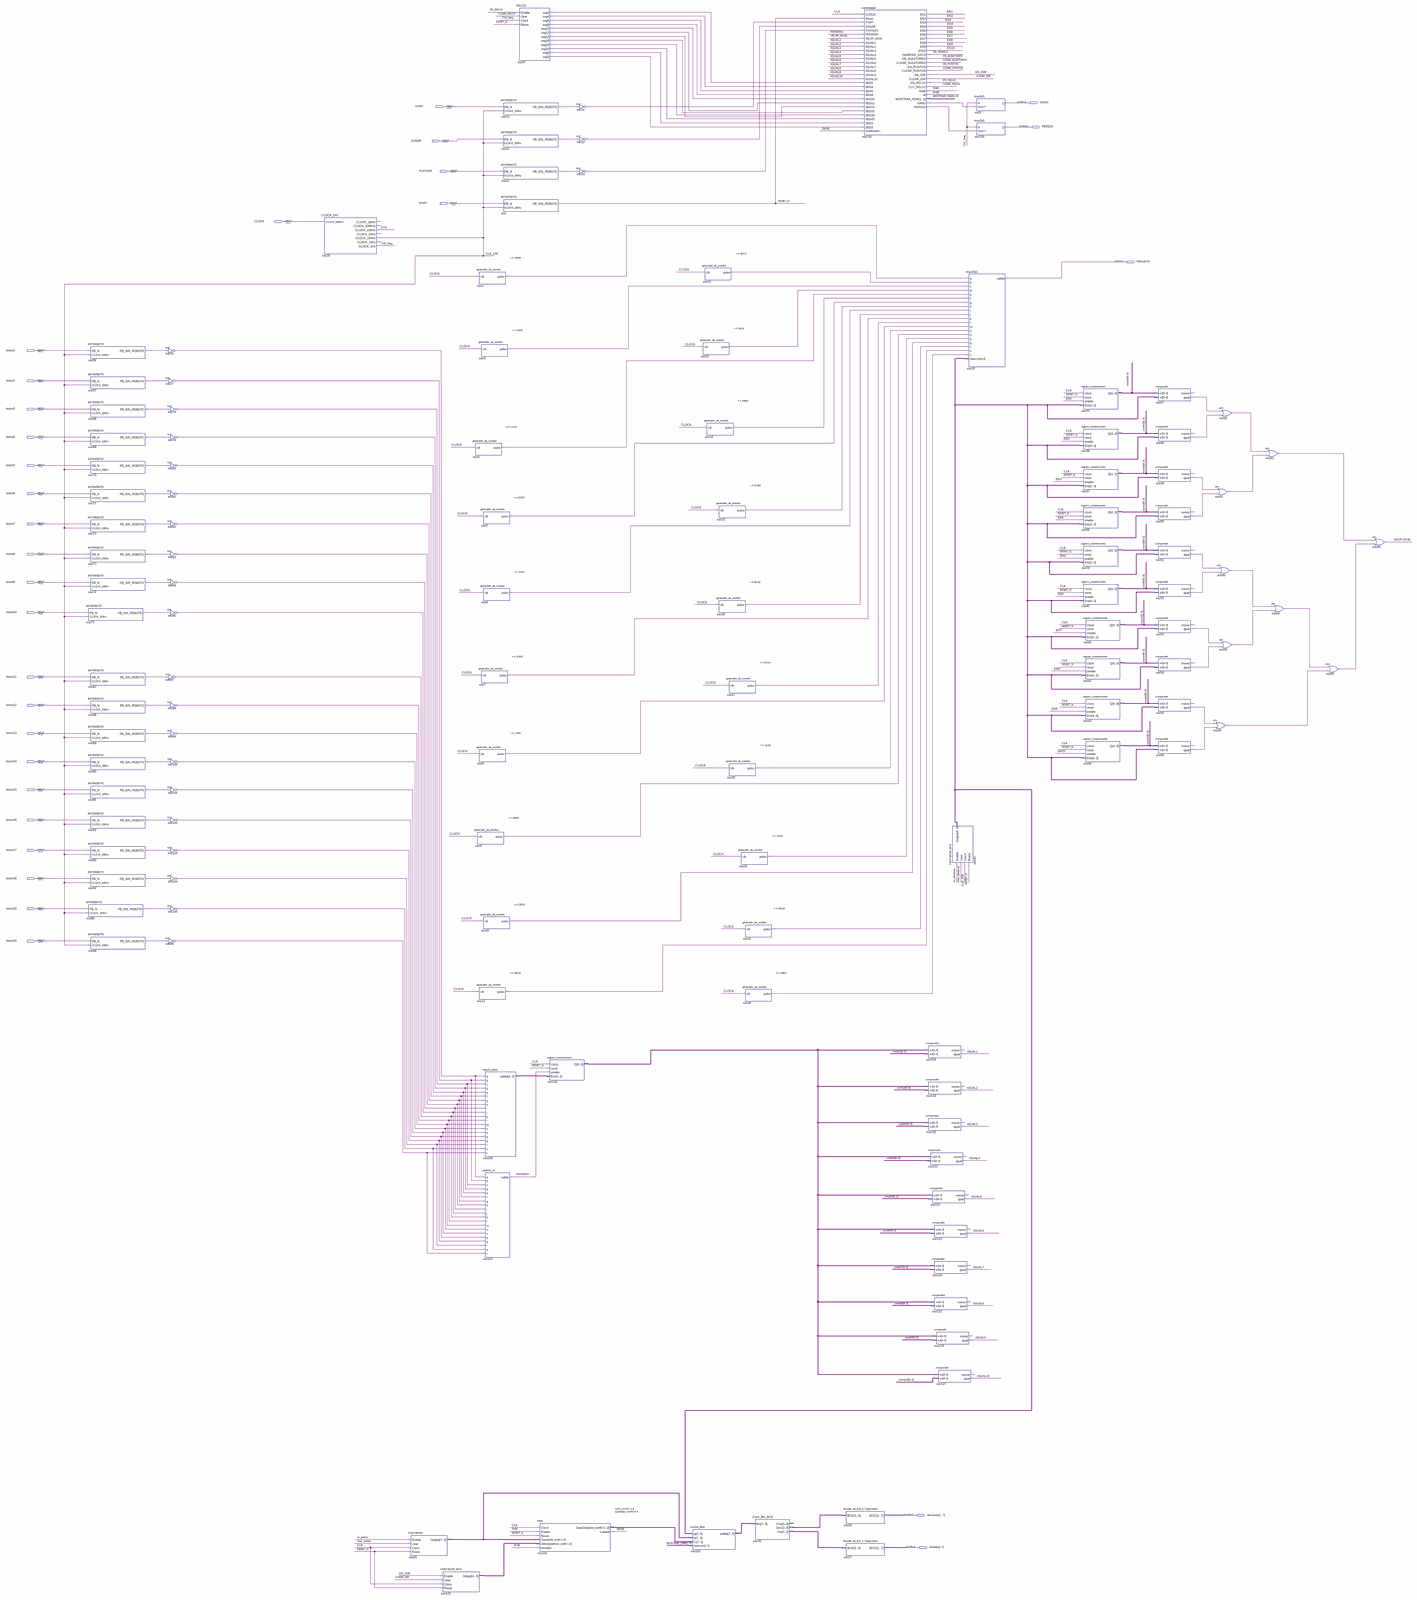
[diagram p0: schematic sheet, whole]
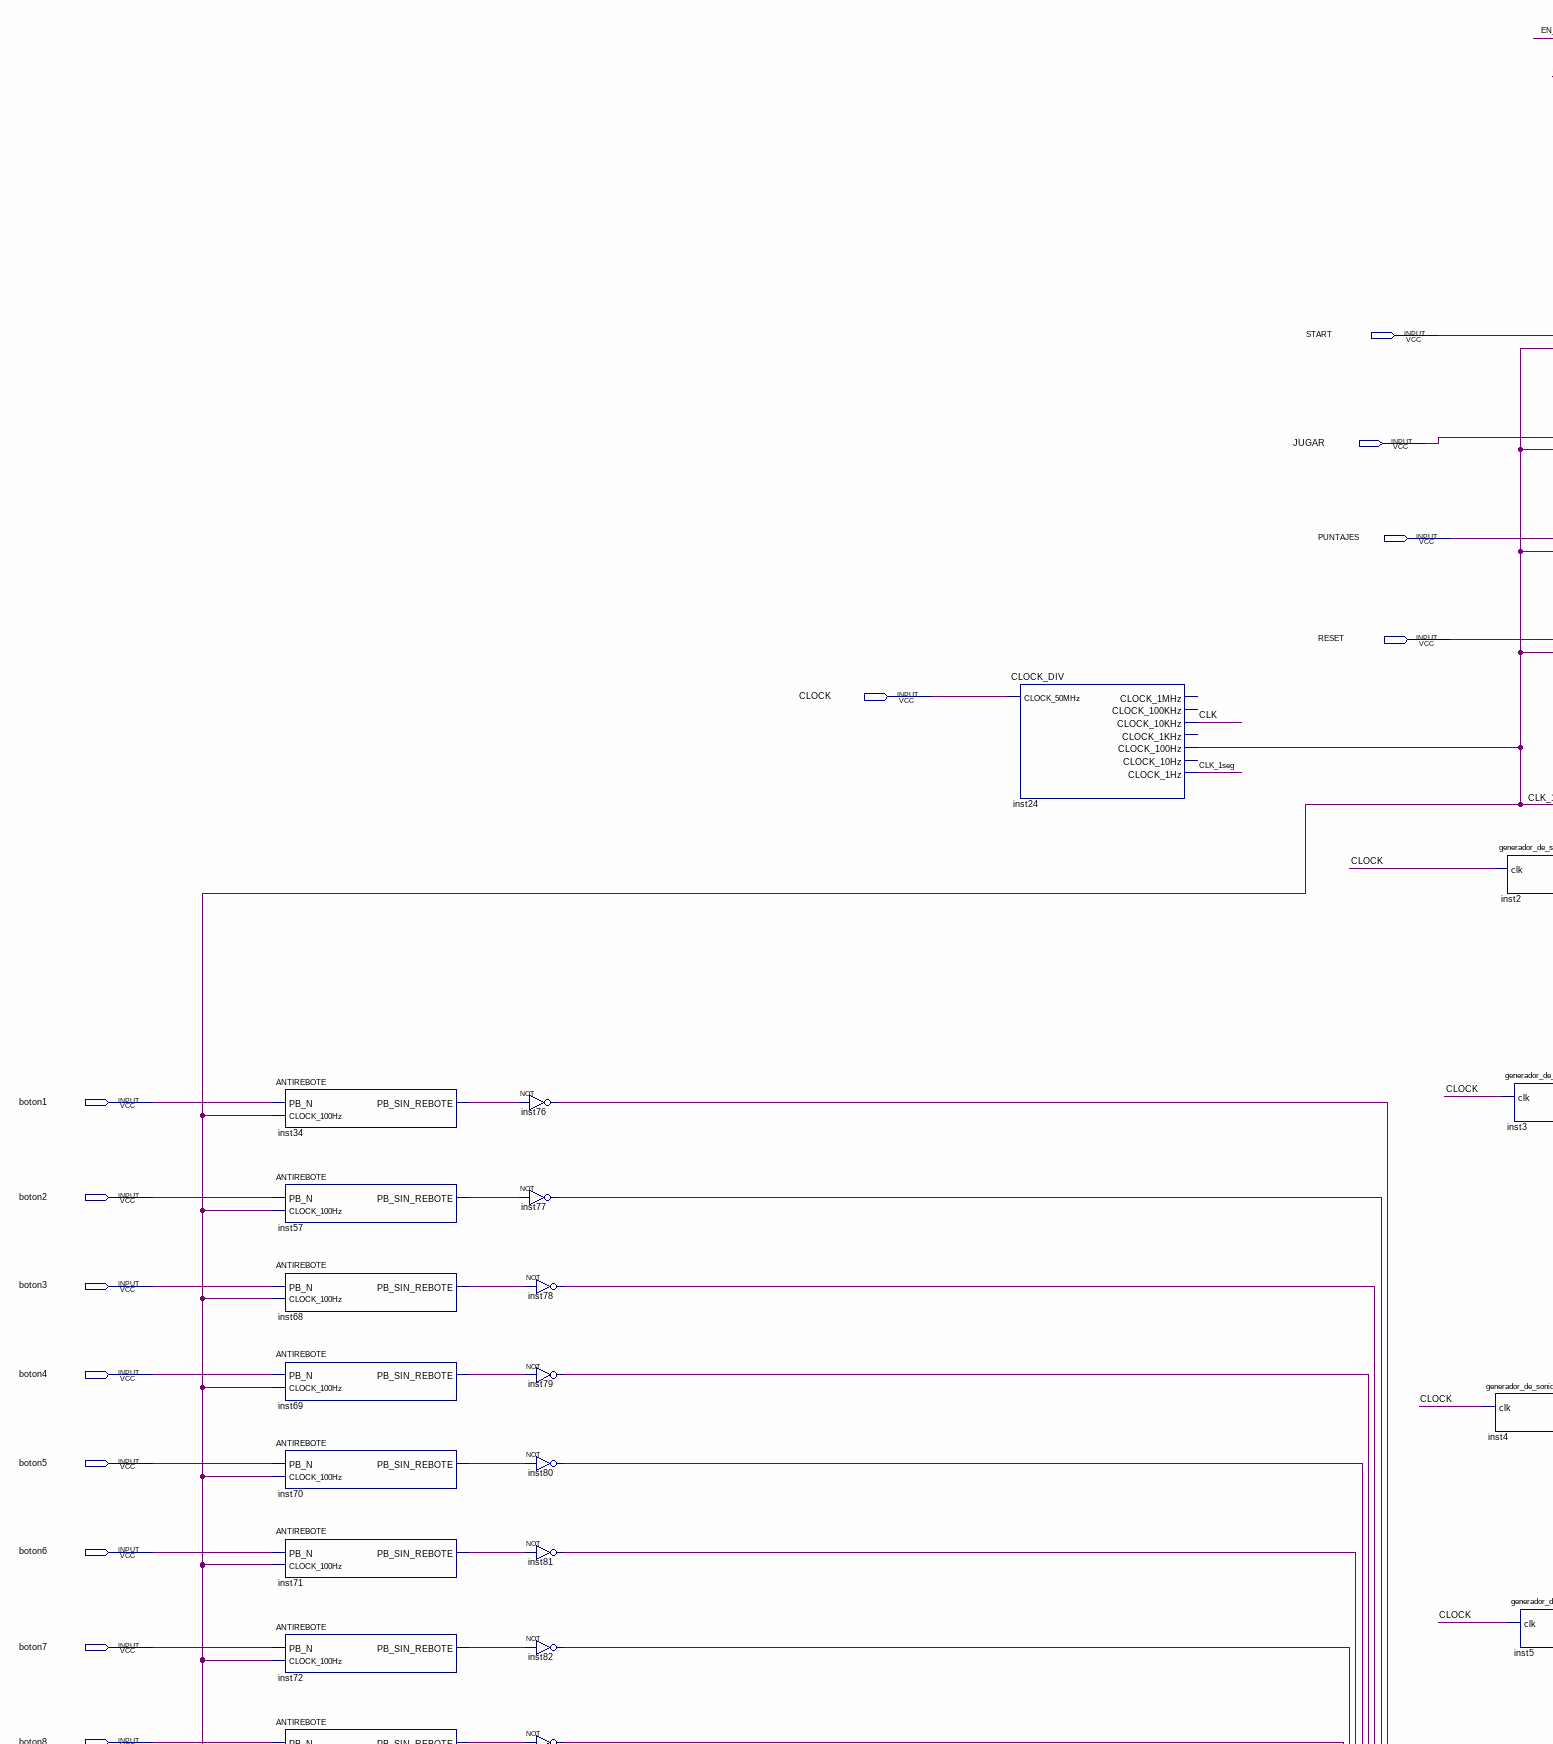
[diagram p1: schematic sheet, upper left part]
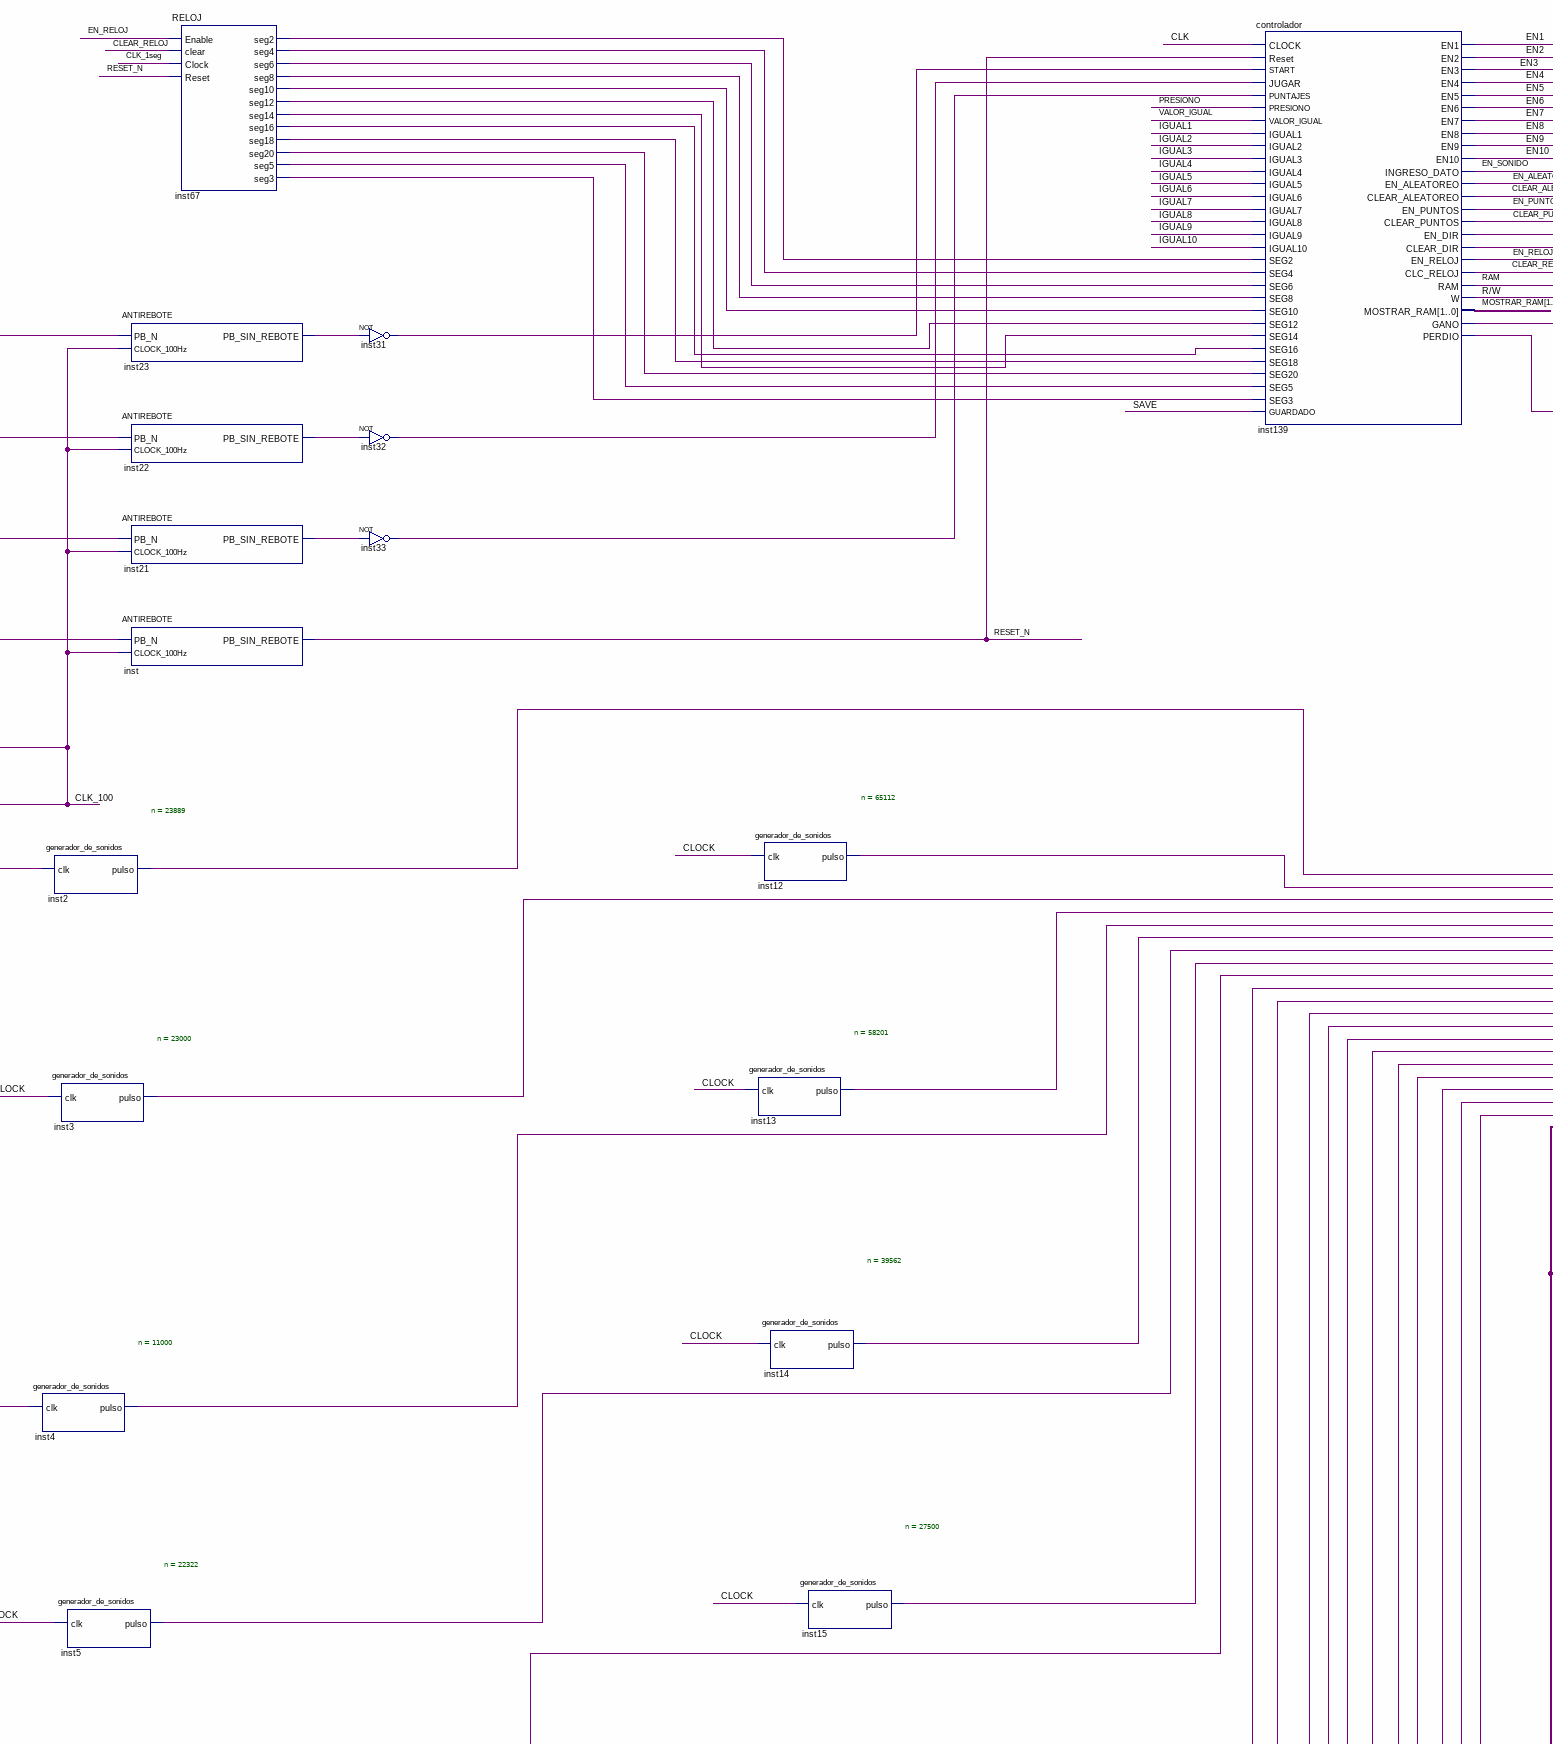
[diagram p2: schematic sheet, upper centre part]
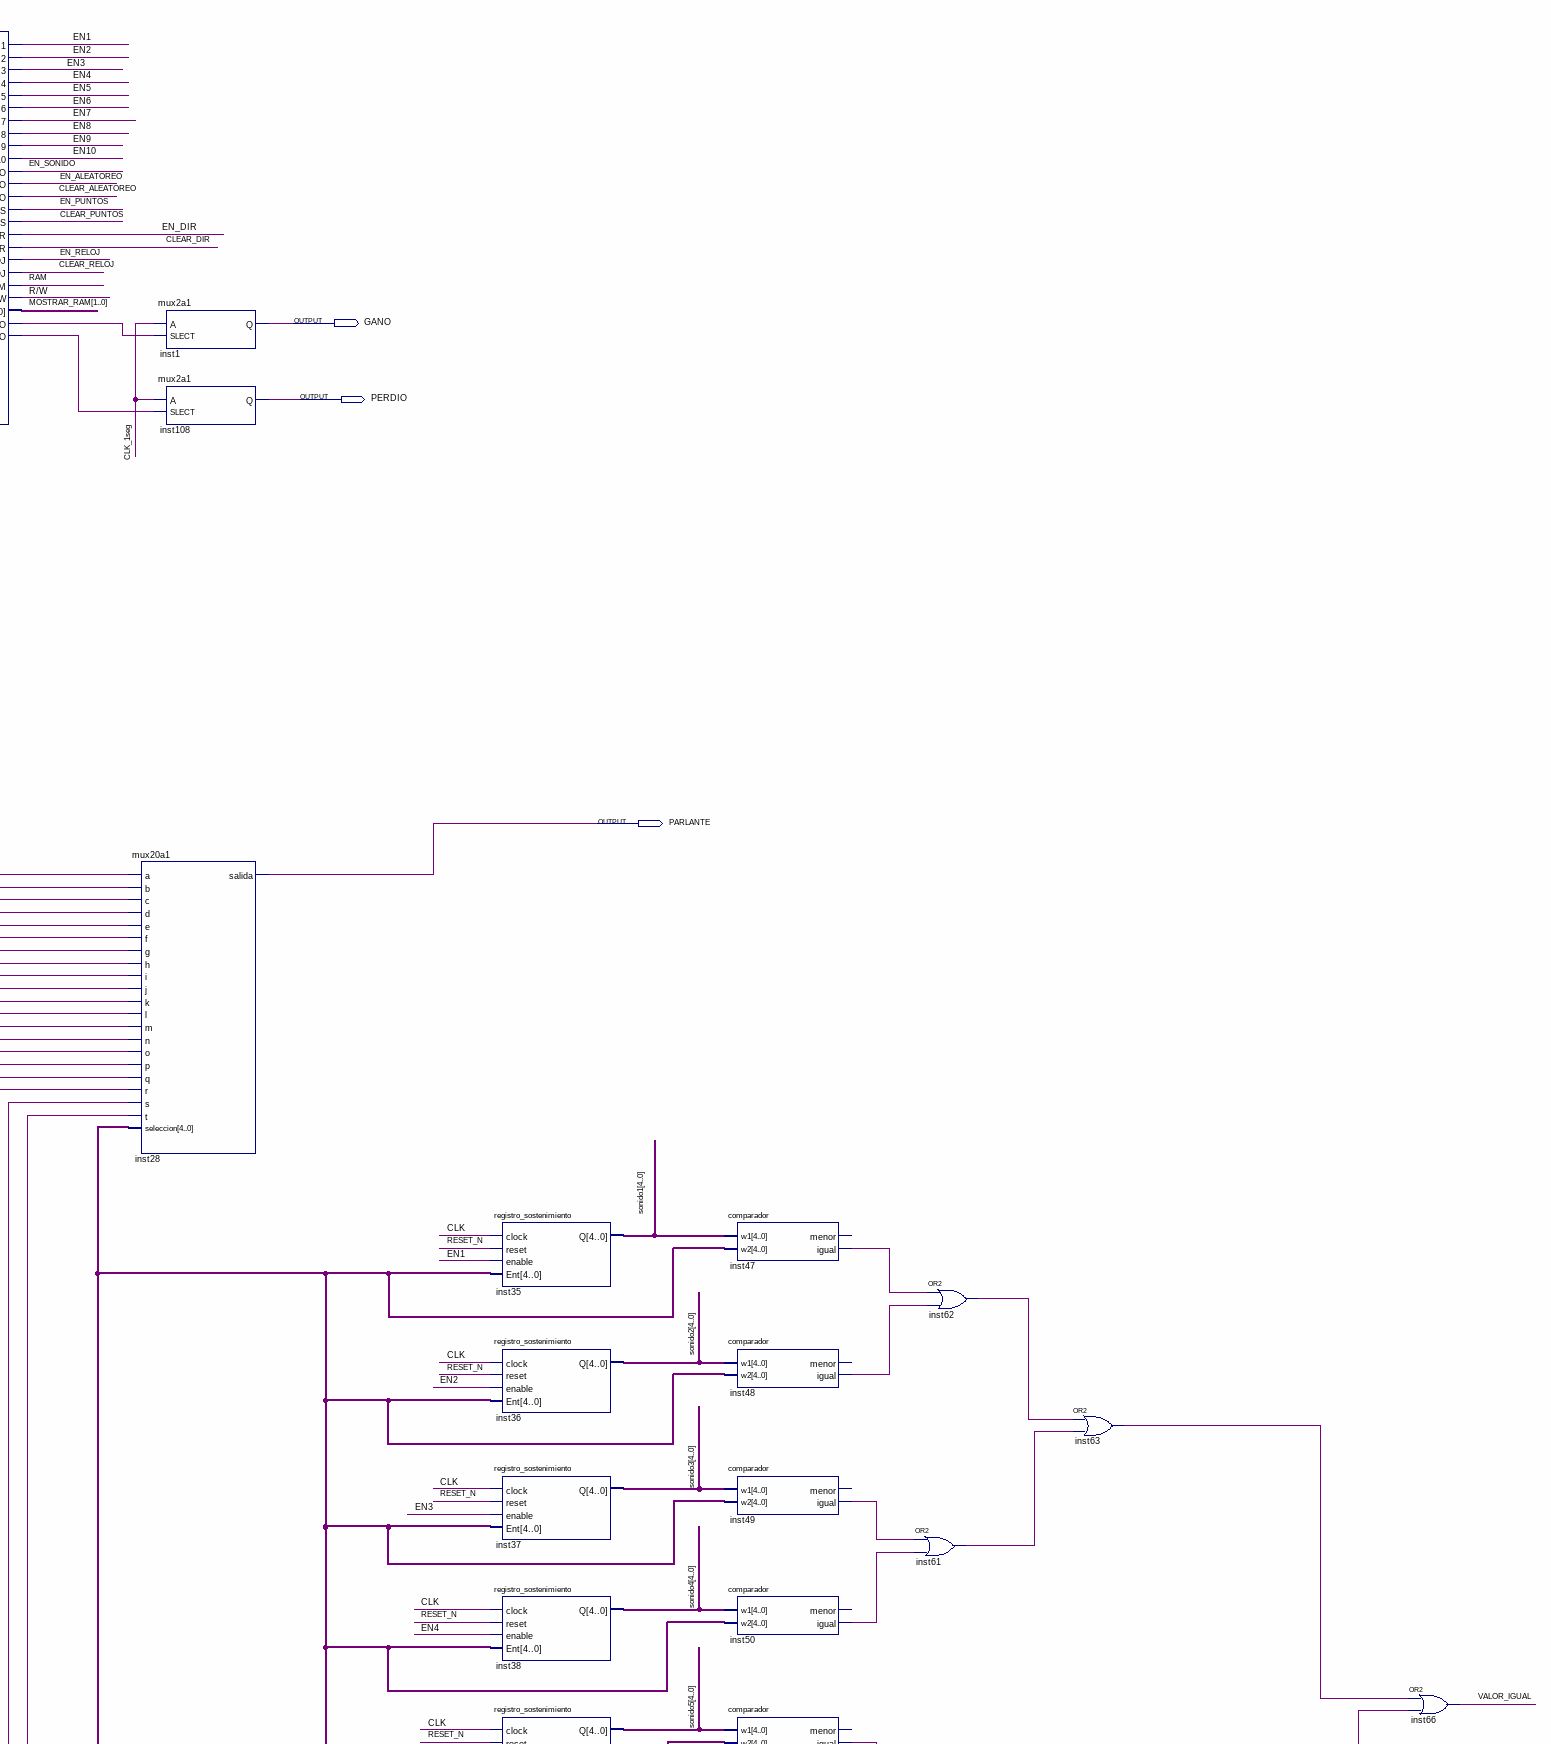
[diagram p3: schematic sheet, upper right part]
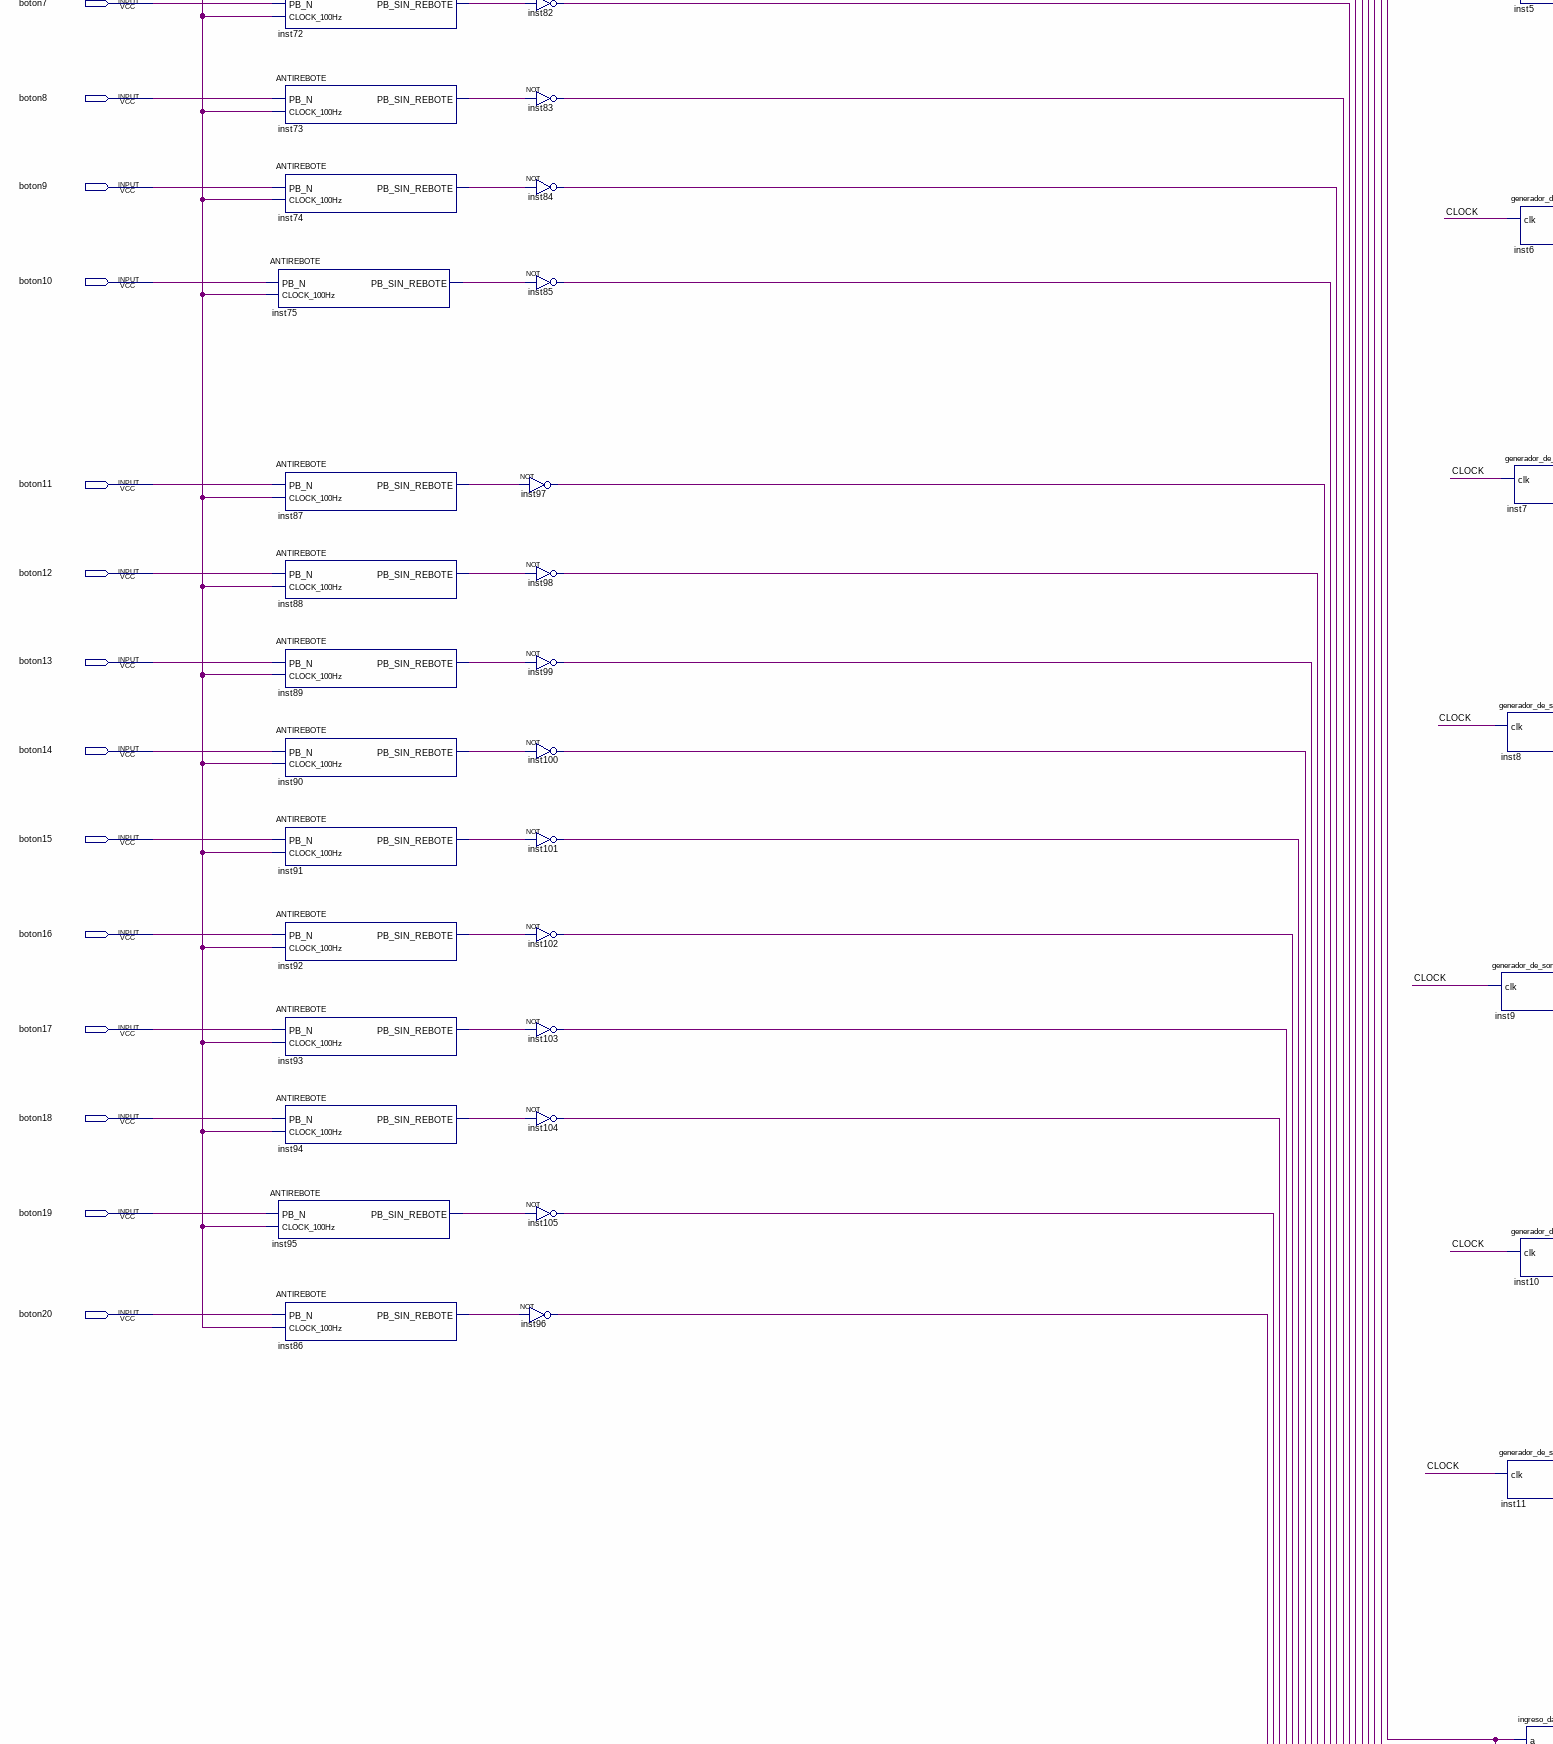
[diagram p4: schematic sheet, middle left part]
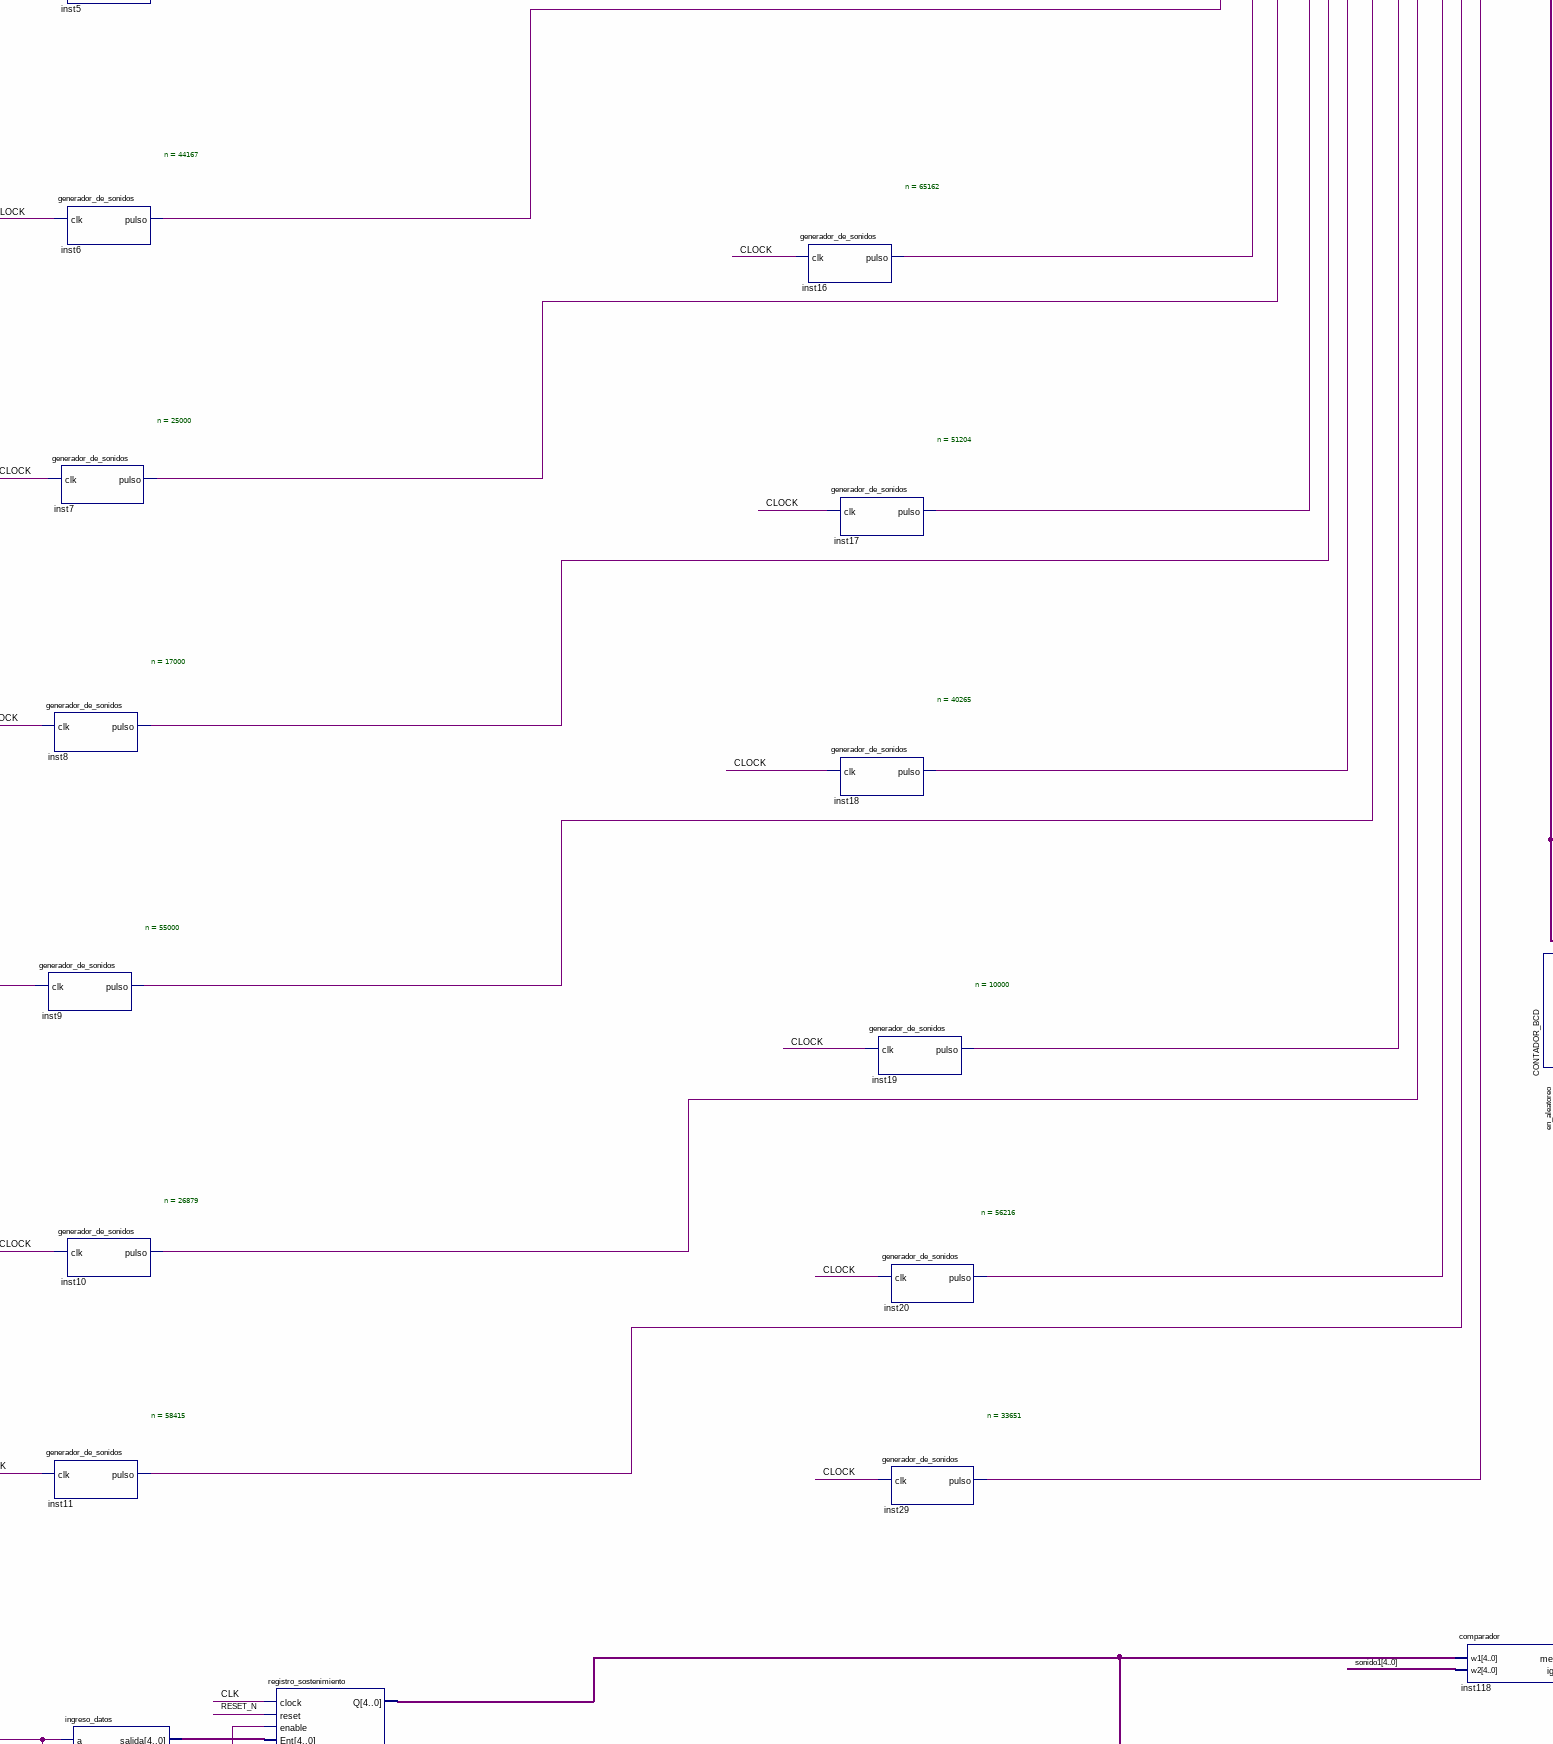
[diagram p5: schematic sheet, middle centre part]
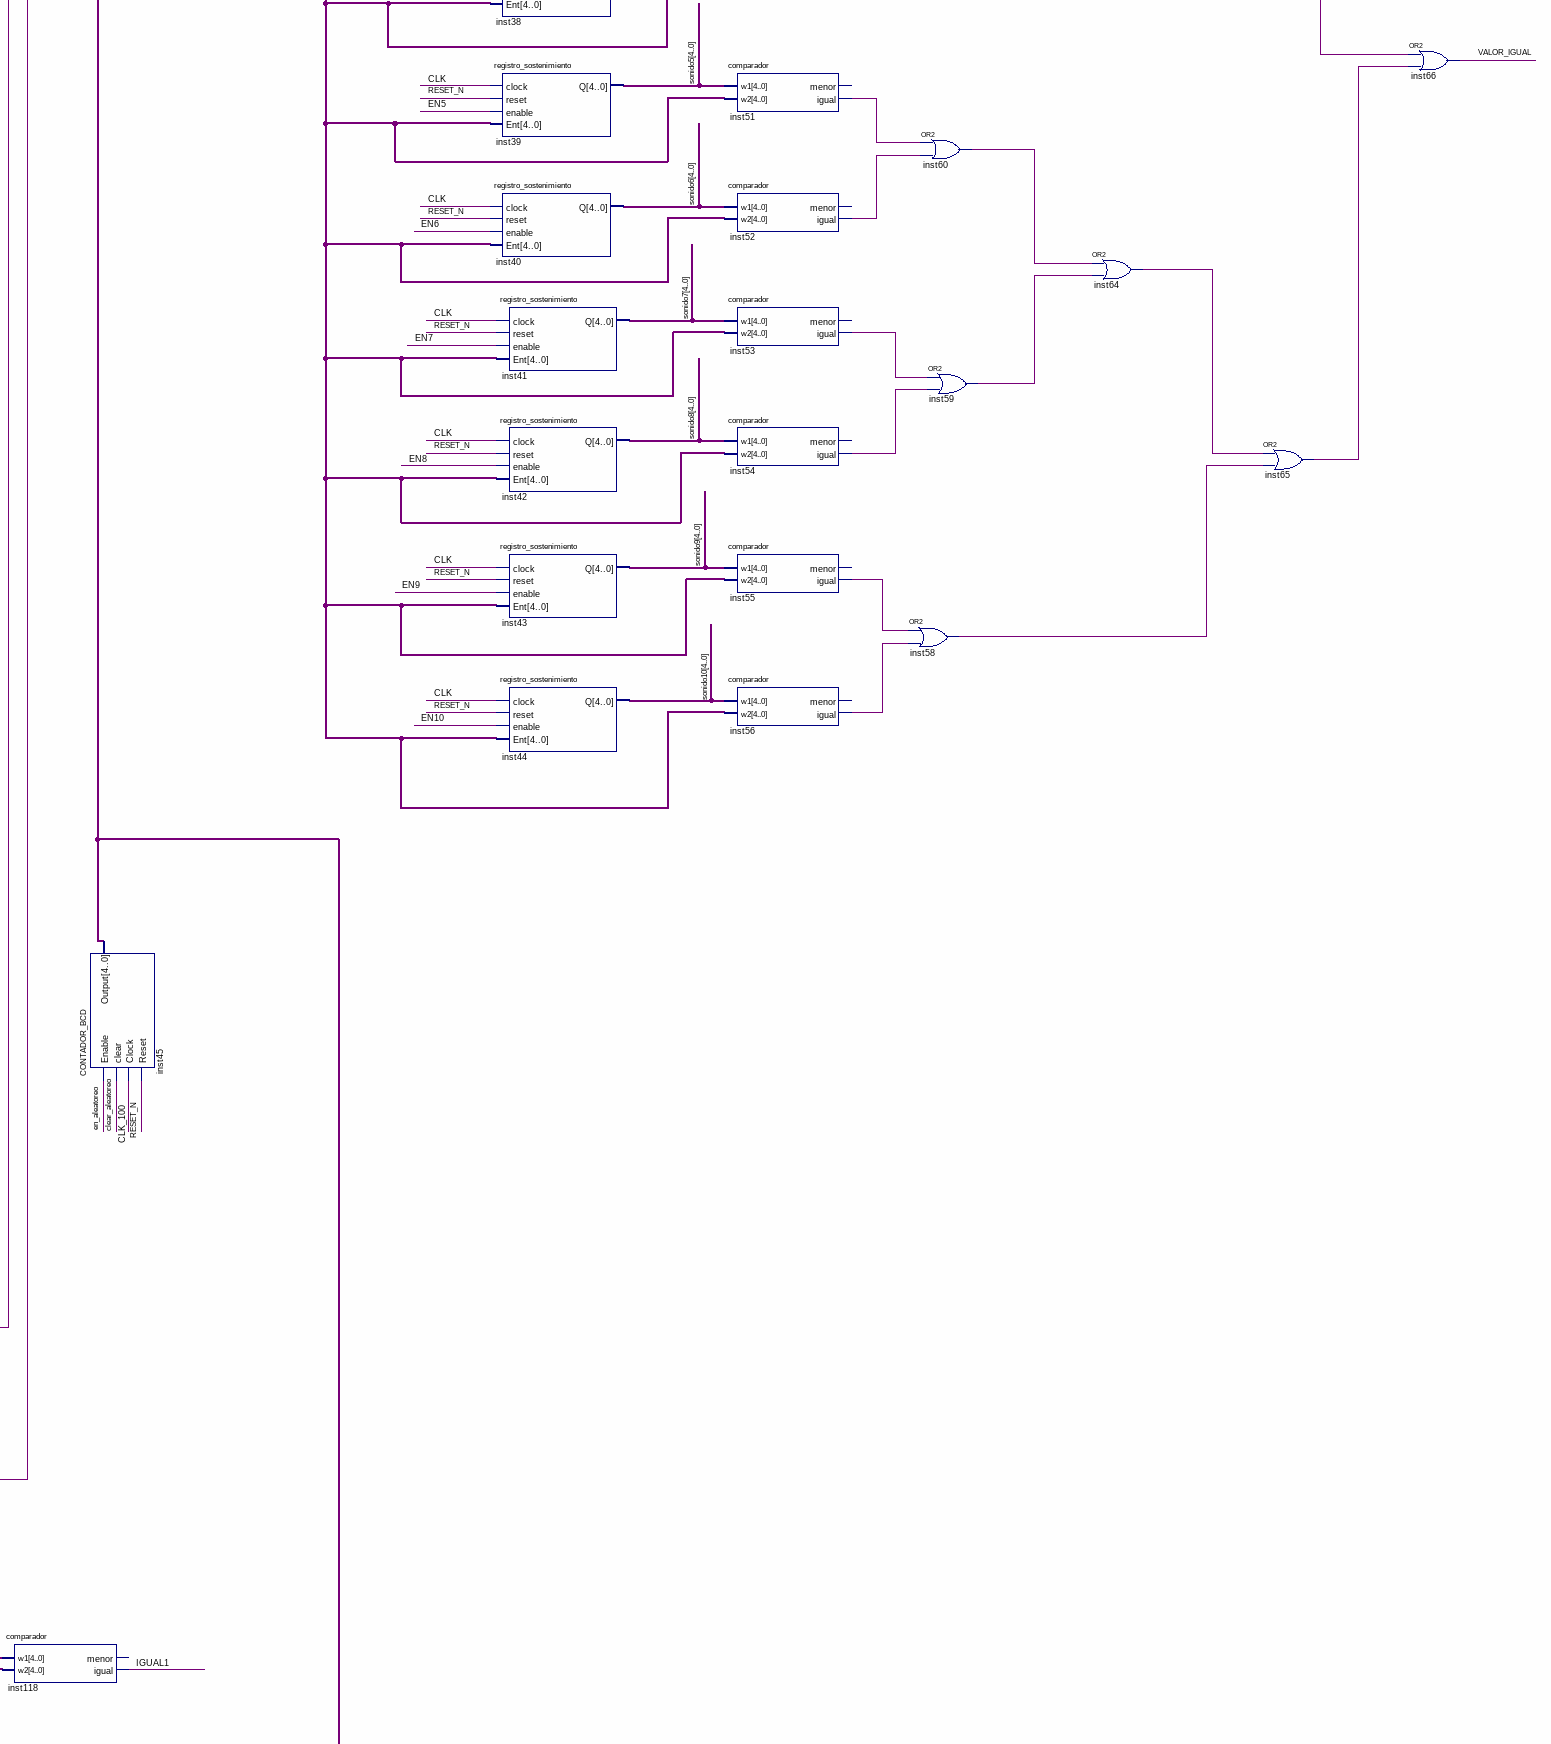
[diagram p6: schematic sheet, middle right part]
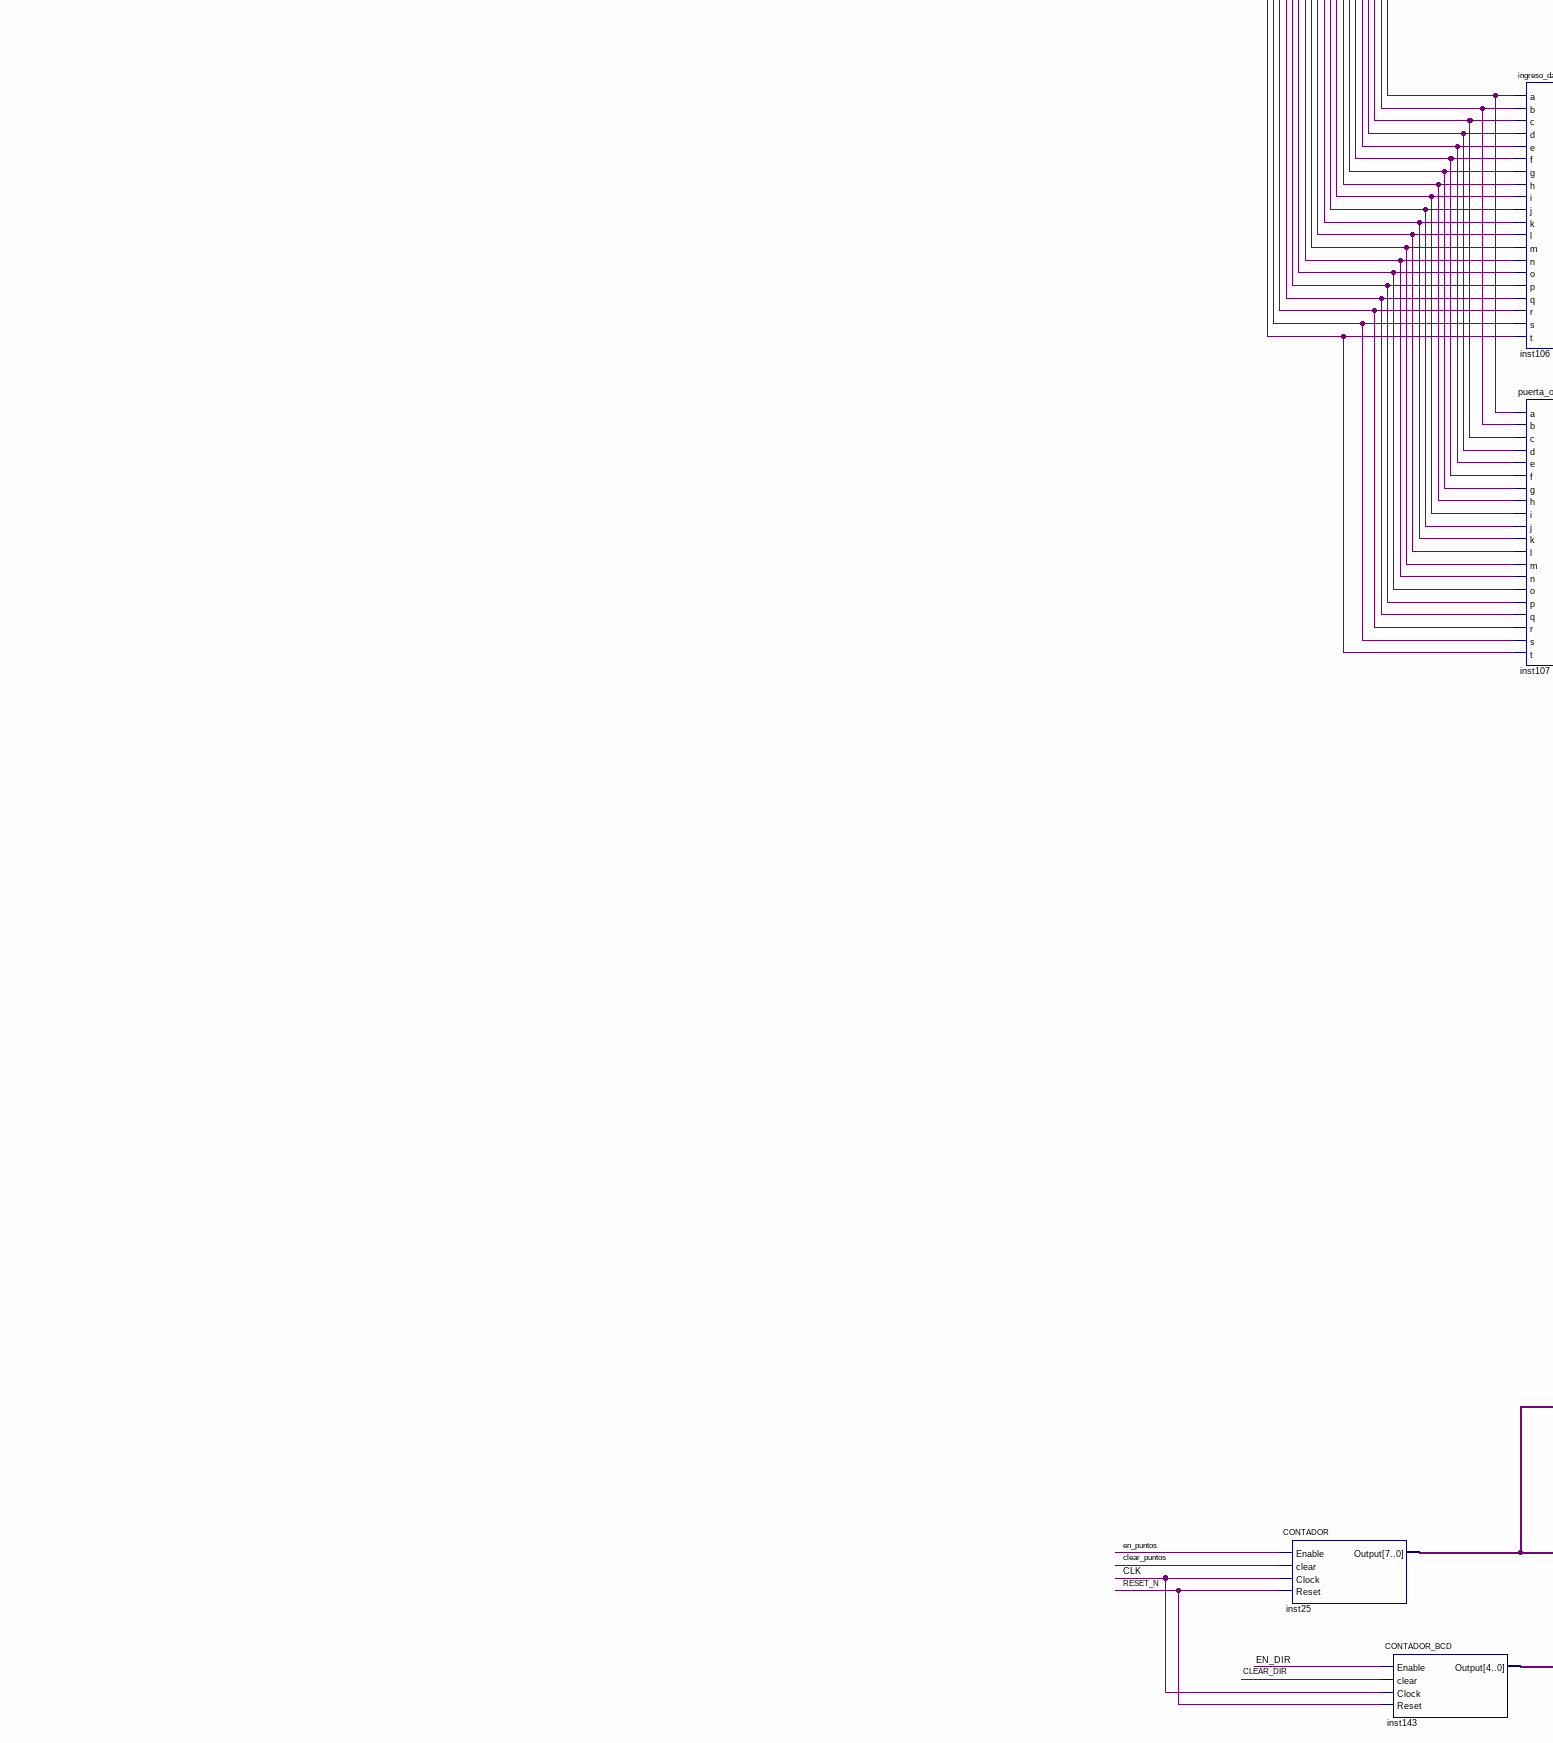
[diagram p7: schematic sheet, lower left part]
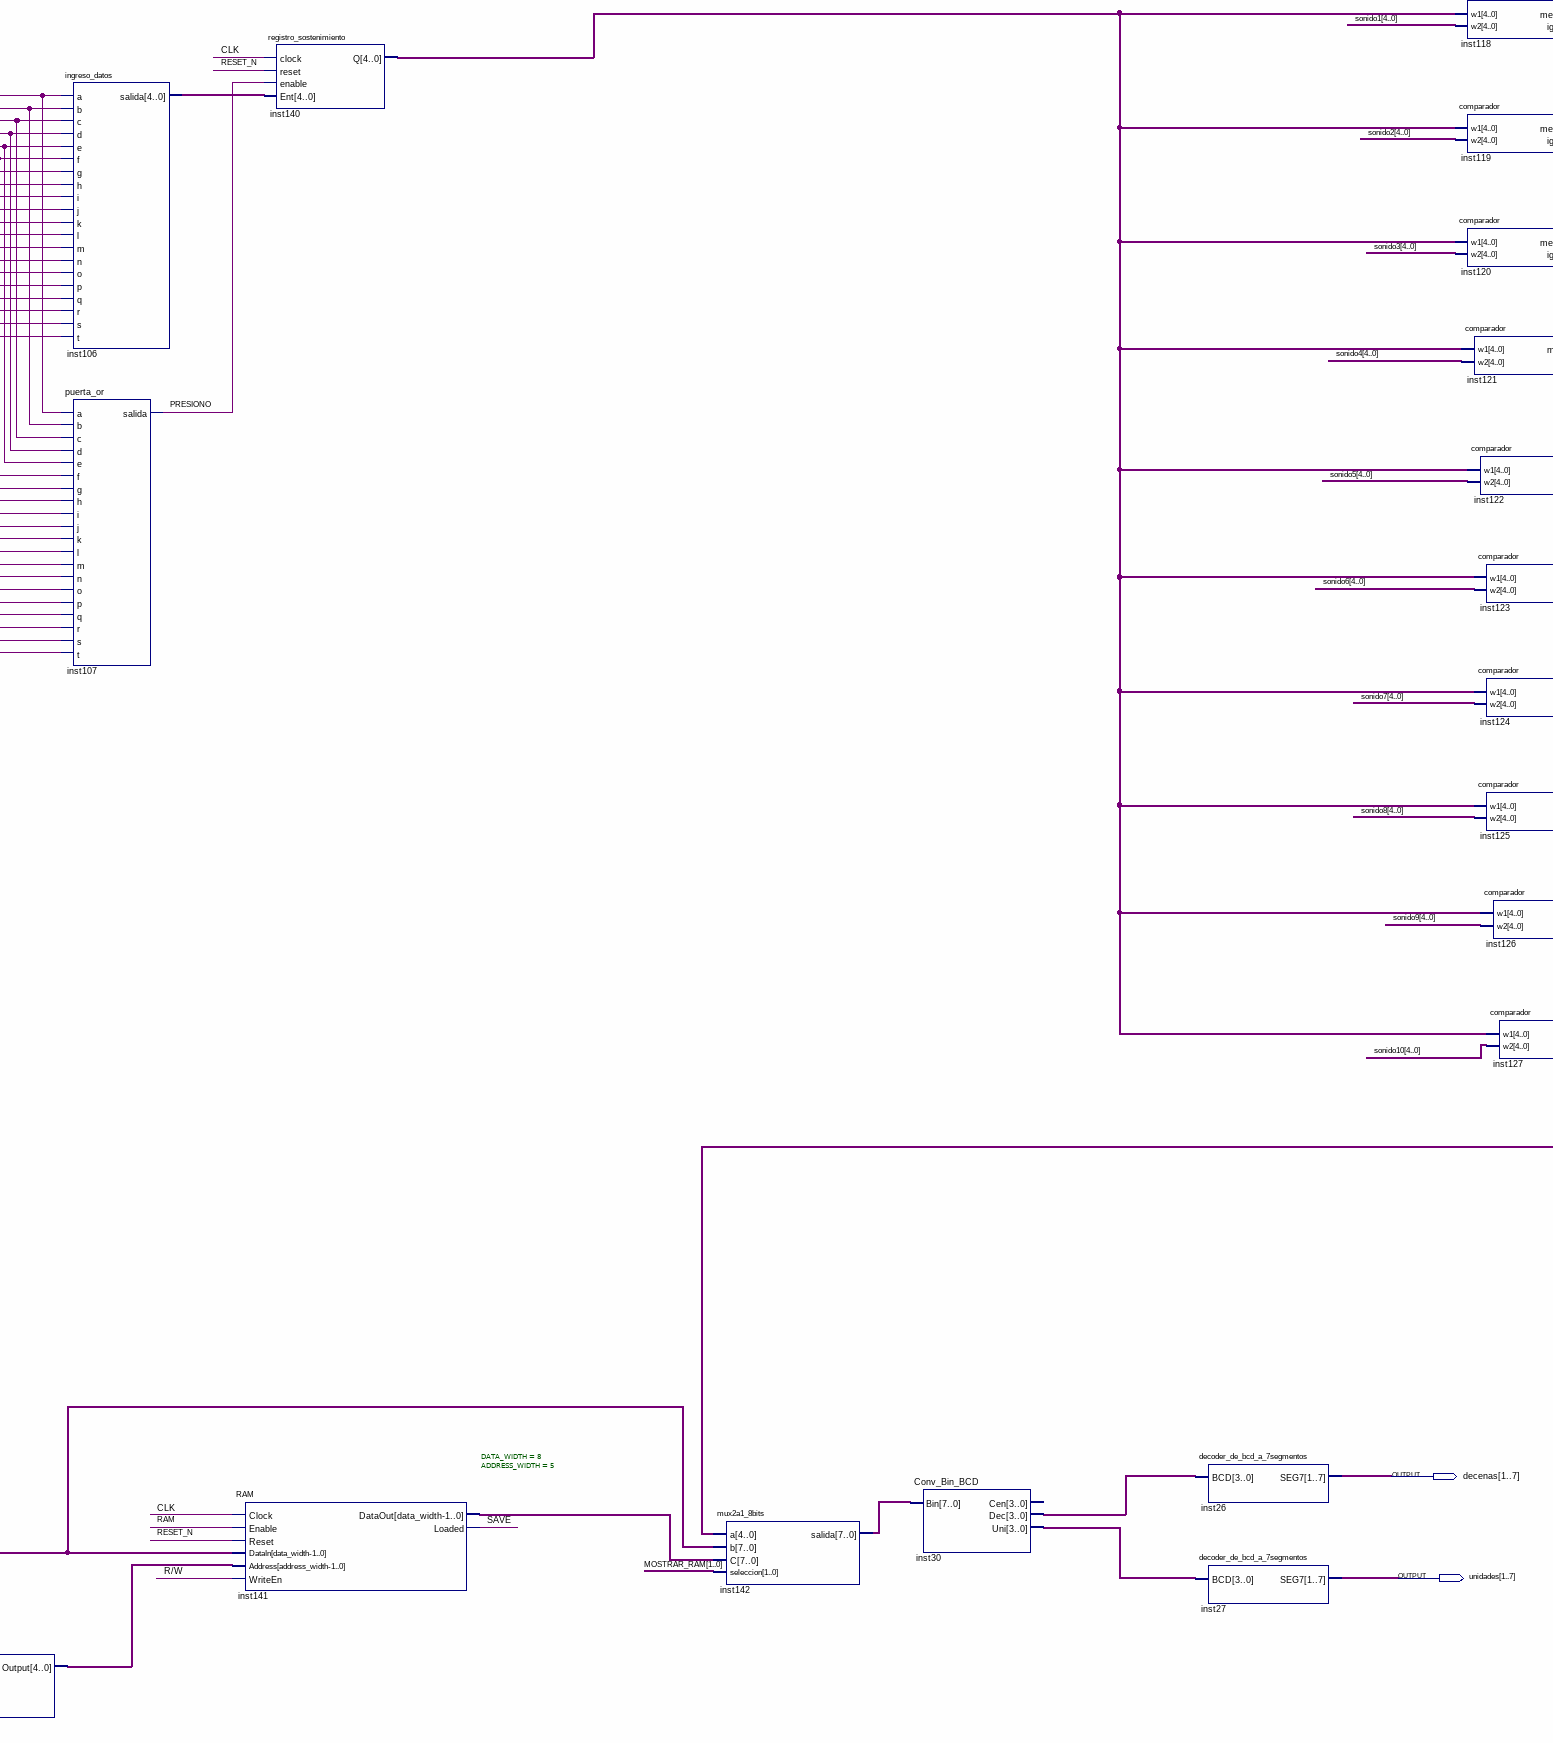
[diagram p8: schematic sheet, lower centre part]
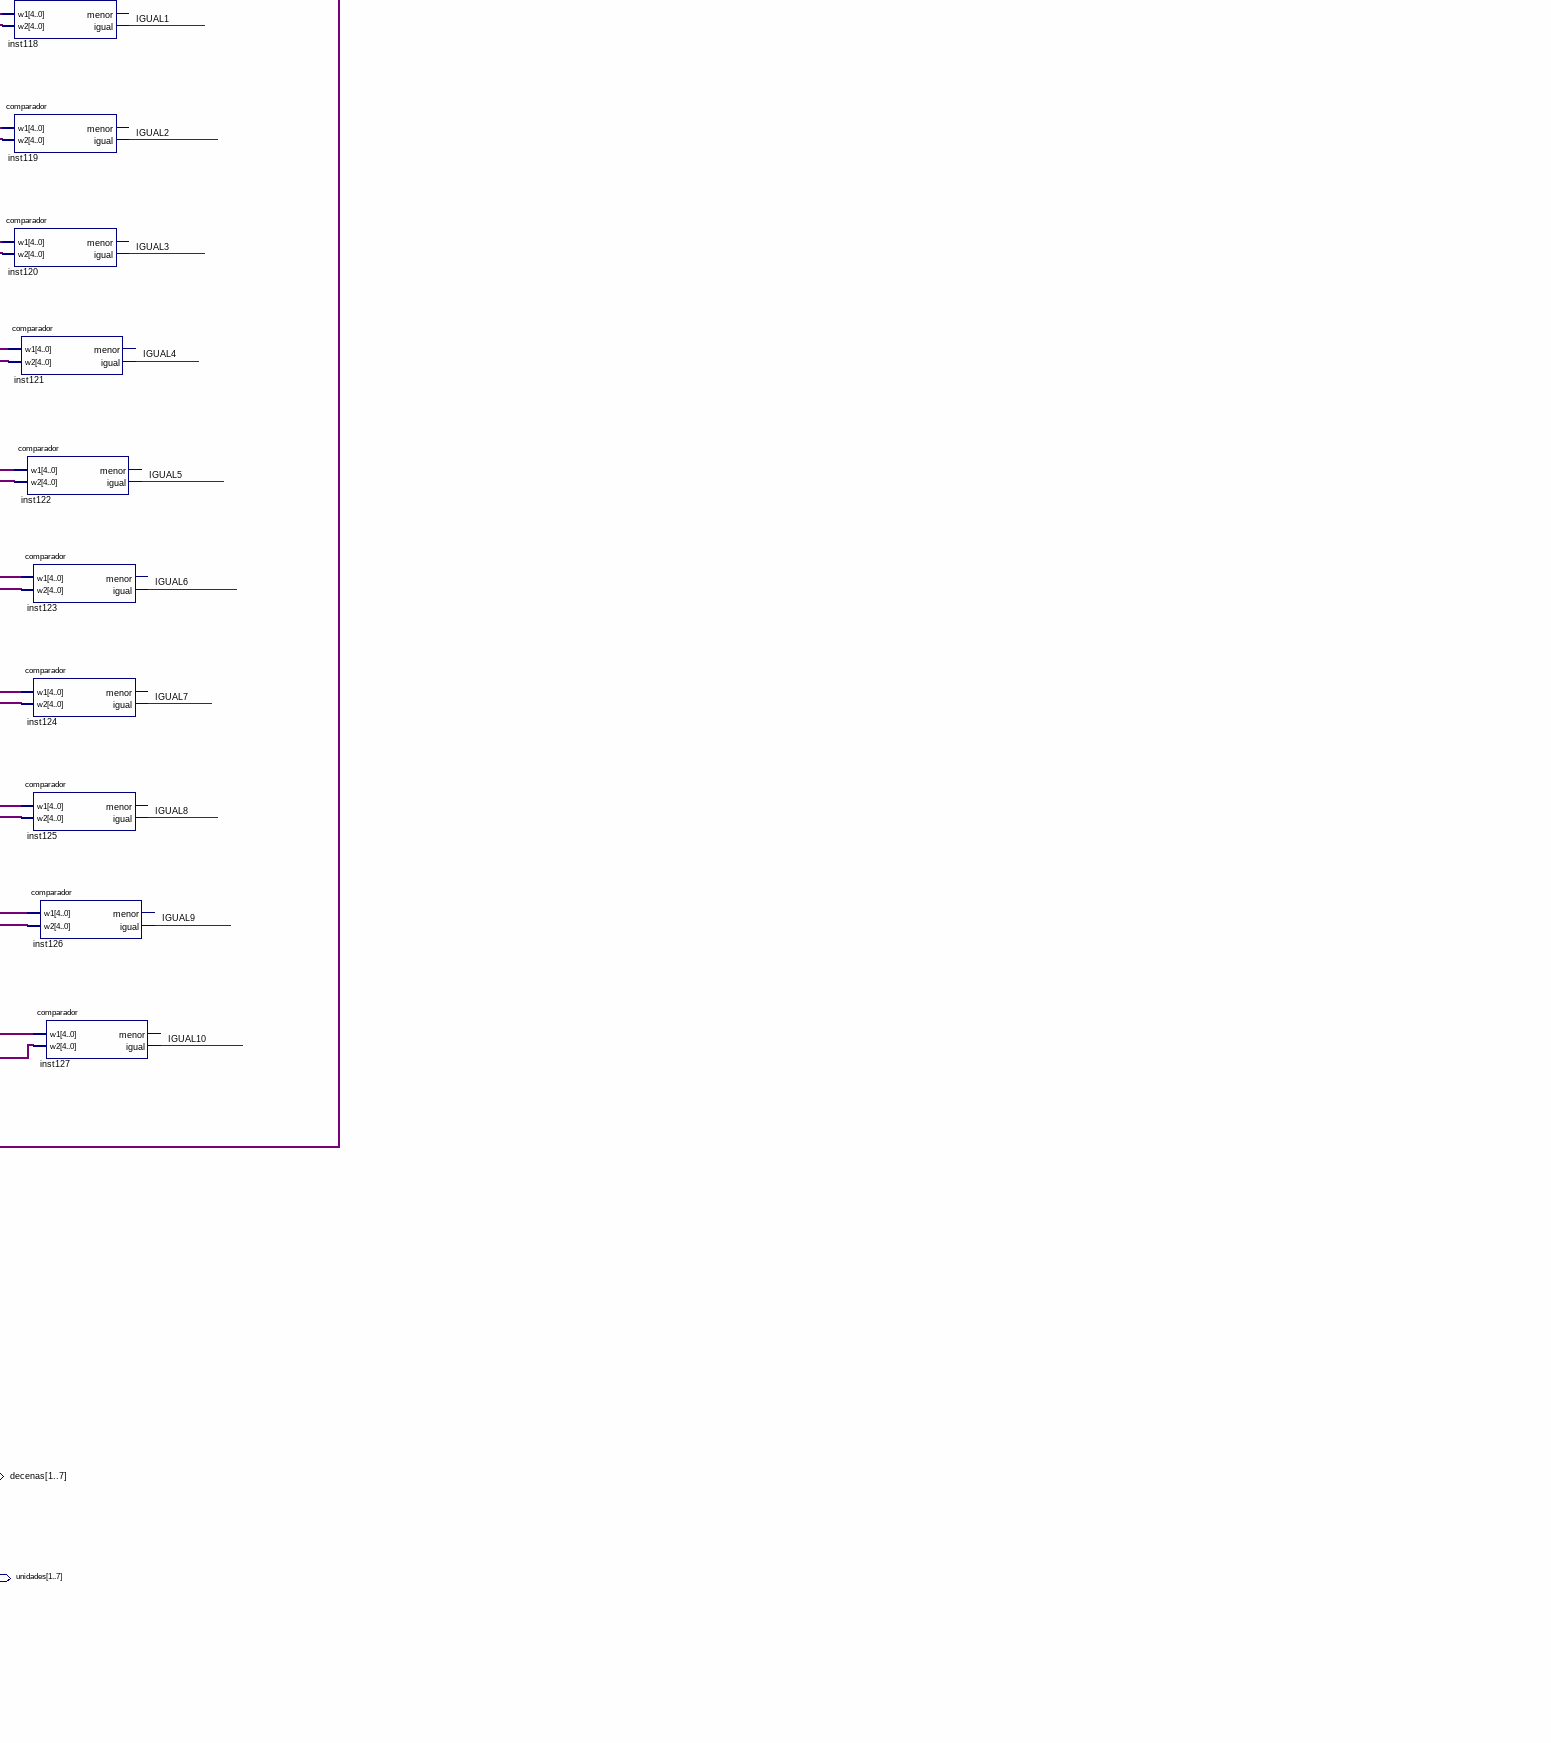
[diagram p9: schematic sheet, lower right part]
// Quartus schematic juego_sonido.bdf as structural Verilog: 123 symbols, 30 pins
module juego_sonido (
  input  START,
  input  JUGAR,
  input  PUNTAJES,
  input  RESET,
  input  CLOCK,
  input  boton1,
  input  boton2,
  input  boton3,
  input  boton4,
  input  boton5,
  input  boton6,
  input  boton7,
  input  boton8,
  input  boton9,
  input  boton10,
  input  boton11,
  input  boton12,
  input  boton13,
  input  boton14,
  input  boton15,
  input  boton16,
  input  boton17,
  input  boton18,
  input  boton19,
  input  boton20,
  output GANO,
  output PERDIO,
  output PARLANTE,
  output [1:7] decenas,
  output [1:7] unidades
);

  wire clear_aleatoreo, CLEAR_DIR, clear_puntos, CLEAR_RELOJ, CLK, CLK_1seg, CLK_100, EN1, EN2, EN3, EN4,
       EN5, EN6, EN7, EN8, EN9, EN10, en_aleatoreo, EN_DIR, en_puntos, EN_RELOJ, EN_SONIDO, IGUAL1, IGUAL2,
       IGUAL3, IGUAL4, IGUAL5, IGUAL6, IGUAL7, IGUAL8, IGUAL9, IGUAL10, inst2_pulso, inst3_pulso,
       inst4_pulso, inst5_pulso, inst6_pulso, inst7_pulso, inst8_pulso, inst9_pulso, inst10_pulso,
       inst11_pulso, inst12_pulso, inst13_pulso, inst14_pulso, inst15_pulso, inst16_pulso, inst17_pulso,
       inst18_pulso, inst19_pulso, inst20_pulso, inst21_pb_sin_rebote, inst22_pb_sin_rebote,
       inst23_pb_sin_rebote, inst29_pulso, inst31_out, inst32_out, inst33_out, inst34_pb_sin_rebote,
       inst47_igual, inst48_igual, inst49_igual, inst50_igual, inst51_igual, inst52_igual, inst53_igual,
       inst54_igual, inst55_igual, inst56_igual, inst57_pb_sin_rebote, inst58_out, inst59_out, inst60_out,
       inst61_out, inst62_out, inst63_out, inst64_out, inst65_out, inst67_seg2, inst67_seg3, inst67_seg4,
       inst67_seg5, inst67_seg6, inst67_seg8, inst67_seg10, inst67_seg12, inst67_seg14, inst67_seg16,
       inst67_seg18, inst67_seg20, inst68_pb_sin_rebote, inst69_pb_sin_rebote, inst70_pb_sin_rebote,
       inst71_pb_sin_rebote, inst72_pb_sin_rebote, inst73_pb_sin_rebote, inst74_pb_sin_rebote,
       inst75_pb_sin_rebote, inst76_out, inst77_out, inst78_out, inst79_out, inst80_out, inst81_out,
       inst82_out, inst83_out, inst84_out, inst85_out, inst86_pb_sin_rebote, inst87_pb_sin_rebote,
       inst88_pb_sin_rebote, inst89_pb_sin_rebote, inst90_pb_sin_rebote, inst91_pb_sin_rebote,
       inst92_pb_sin_rebote, inst93_pb_sin_rebote, inst94_pb_sin_rebote, inst95_pb_sin_rebote, inst96_out,
       inst97_out, inst98_out, inst99_out, inst100_out, inst101_out, inst102_out, inst103_out, inst104_out,
       inst105_out, inst139_gano, inst139_perdio, PRESIONO, \R/W , RAM, RESET_N, SAVE, VALOR_IGUAL;
  wire [1:0] MOSTRAR_RAM;
  wire [3:0] inst30_dec, inst30_uni;
  wire [4:0] inst45_output, inst106_salida, inst140_q, inst143_output, sonido1, sonido2, sonido3, sonido4,
       sonido5, sonido6, sonido7, sonido8, sonido9, sonido10;
  wire [7:0] inst25_output, inst141_dataout, inst142_salida;

  ANTIREBOTE inst34 (.PB_N(boton1), .CLOCK_100Hz(CLK_100), .PB_SIN_REBOTE(inst34_pb_sin_rebote));
  ANTIREBOTE inst57 (.PB_N(boton2), .CLOCK_100Hz(CLK_100), .PB_SIN_REBOTE(inst57_pb_sin_rebote));
  ANTIREBOTE inst68 (.PB_N(boton3), .CLOCK_100Hz(CLK_100), .PB_SIN_REBOTE(inst68_pb_sin_rebote));
  ANTIREBOTE inst69 (.PB_N(boton4), .CLOCK_100Hz(CLK_100), .PB_SIN_REBOTE(inst69_pb_sin_rebote));
  ANTIREBOTE inst70 (.PB_N(boton5), .CLOCK_100Hz(CLK_100), .PB_SIN_REBOTE(inst70_pb_sin_rebote));
  ANTIREBOTE inst71 (.PB_N(boton6), .CLOCK_100Hz(CLK_100), .PB_SIN_REBOTE(inst71_pb_sin_rebote));
  ANTIREBOTE inst72 (.PB_N(boton7), .CLOCK_100Hz(CLK_100), .PB_SIN_REBOTE(inst72_pb_sin_rebote));
  ANTIREBOTE inst73 (.PB_N(boton8), .CLOCK_100Hz(CLK_100), .PB_SIN_REBOTE(inst73_pb_sin_rebote));
  ANTIREBOTE inst74 (.PB_N(boton9), .CLOCK_100Hz(CLK_100), .PB_SIN_REBOTE(inst74_pb_sin_rebote));
  ANTIREBOTE inst75 (.PB_N(boton10), .CLOCK_100Hz(CLK_100), .PB_SIN_REBOTE(inst75_pb_sin_rebote));
  ANTIREBOTE inst87 (.PB_N(boton11), .CLOCK_100Hz(CLK_100), .PB_SIN_REBOTE(inst87_pb_sin_rebote));
  ANTIREBOTE inst88 (.PB_N(boton12), .CLOCK_100Hz(CLK_100), .PB_SIN_REBOTE(inst88_pb_sin_rebote));
  ANTIREBOTE inst89 (.PB_N(boton13), .CLOCK_100Hz(CLK_100), .PB_SIN_REBOTE(inst89_pb_sin_rebote));
  ANTIREBOTE inst90 (.PB_N(boton14), .CLOCK_100Hz(CLK_100), .PB_SIN_REBOTE(inst90_pb_sin_rebote));
  ANTIREBOTE inst91 (.PB_N(boton15), .CLOCK_100Hz(CLK_100), .PB_SIN_REBOTE(inst91_pb_sin_rebote));
  ANTIREBOTE inst92 (.PB_N(boton16), .CLOCK_100Hz(CLK_100), .PB_SIN_REBOTE(inst92_pb_sin_rebote));
  ANTIREBOTE inst93 (.PB_N(boton17), .CLOCK_100Hz(CLK_100), .PB_SIN_REBOTE(inst93_pb_sin_rebote));
  ANTIREBOTE inst94 (.PB_N(boton18), .CLOCK_100Hz(CLK_100), .PB_SIN_REBOTE(inst94_pb_sin_rebote));
  ANTIREBOTE inst95 (.PB_N(boton19), .CLOCK_100Hz(CLK_100), .PB_SIN_REBOTE(inst95_pb_sin_rebote));
  ANTIREBOTE inst86 (.PB_N(boton20), .CLOCK_100Hz(CLK_100), .PB_SIN_REBOTE(inst86_pb_sin_rebote));
  not inst76 (inst76_out, inst34_pb_sin_rebote);
  not inst77 (inst77_out, inst57_pb_sin_rebote);
  not inst78 (inst78_out, inst68_pb_sin_rebote);
  not inst79 (inst79_out, inst69_pb_sin_rebote);
  not inst80 (inst80_out, inst70_pb_sin_rebote);
  not inst81 (inst81_out, inst71_pb_sin_rebote);
  not inst82 (inst82_out, inst72_pb_sin_rebote);
  not inst83 (inst83_out, inst73_pb_sin_rebote);
  not inst84 (inst84_out, inst74_pb_sin_rebote);
  not inst85 (inst85_out, inst75_pb_sin_rebote);
  not inst97 (inst97_out, inst87_pb_sin_rebote);
  not inst98 (inst98_out, inst88_pb_sin_rebote);
  not inst99 (inst99_out, inst89_pb_sin_rebote);
  not inst100 (inst100_out, inst90_pb_sin_rebote);
  not inst101 (inst101_out, inst91_pb_sin_rebote);
  not inst102 (inst102_out, inst92_pb_sin_rebote);
  not inst103 (inst103_out, inst93_pb_sin_rebote);
  not inst104 (inst104_out, inst94_pb_sin_rebote);
  not inst105 (inst105_out, inst95_pb_sin_rebote);
  not inst96 (inst96_out, inst86_pb_sin_rebote);
  CLOCK_DIV inst24 (
    .CLOCK_50MHz(CLOCK), .CLOCK_10KHz(CLK), .CLOCK_100Hz(CLK_100), .CLOCK_1Hz(CLK_1seg));  // open: CLOCK_1MHz, CLOCK_100KHz, CLOCK_1KHz, CLOCK_10Hz
  CONTADOR inst25 (.Enable(en_puntos), .clear(clear_puntos), .Clock(CLK), .Reset(RESET_N), .Output(inst25_output));
  CONTADOR_BCD inst143 (.Enable(EN_DIR), .clear(CLEAR_DIR), .Clock(CLK), .Reset(RESET_N), .Output(inst143_output));
  generador_de_sonidos #(.n(23889)) inst2 (.clk(CLOCK), .pulso(inst2_pulso));
  generador_de_sonidos #(.n(11000)) inst4 (.clk(CLOCK), .pulso(inst4_pulso));
  generador_de_sonidos #(.n(17000)) inst8 (.clk(CLOCK), .pulso(inst8_pulso));
  generador_de_sonidos #(.n(55000)) inst9 (.clk(CLOCK), .pulso(inst9_pulso));
  generador_de_sonidos #(.n(58415)) inst11 (.clk(CLOCK), .pulso(inst11_pulso));
  generador_de_sonidos #(.n(23000)) inst3 (.clk(CLOCK), .pulso(inst3_pulso));
  generador_de_sonidos #(.n(22322)) inst5 (.clk(CLOCK), .pulso(inst5_pulso));
  generador_de_sonidos #(.n(44167)) inst6 (.clk(CLOCK), .pulso(inst6_pulso));
  generador_de_sonidos #(.n(25000)) inst7 (.clk(CLOCK), .pulso(inst7_pulso));
  generador_de_sonidos #(.n(26879)) inst10 (.clk(CLOCK), .pulso(inst10_pulso));
  ingreso_datos inst106 (
    .a(inst76_out), .b(inst77_out), .c(inst78_out), .d(inst79_out), .e(inst80_out), .f(inst81_out),
    .g(inst82_out), .h(inst83_out), .i(inst84_out), .j(inst85_out), .k(inst97_out), .l(inst98_out),
    .m(inst99_out), .n(inst100_out), .o(inst101_out), .p(inst102_out), .q(inst103_out), .r(inst104_out),
    .s(inst105_out), .t(inst96_out), .salida(inst106_salida));
  puerta_or inst107 (
    .a(inst76_out), .b(inst77_out), .c(inst78_out), .d(inst79_out), .e(inst80_out), .f(inst81_out),
    .g(inst82_out), .h(inst83_out), .i(inst84_out), .j(inst85_out), .k(inst97_out), .l(inst98_out),
    .m(inst99_out), .n(inst100_out), .o(inst101_out), .p(inst102_out), .q(inst103_out), .r(inst104_out),
    .s(inst105_out), .t(inst96_out), .salida(PRESIONO));
  ANTIREBOTE inst23 (.PB_N(START), .CLOCK_100Hz(CLK_100), .PB_SIN_REBOTE(inst23_pb_sin_rebote));
  ANTIREBOTE inst22 (.PB_N(JUGAR), .CLOCK_100Hz(CLK_100), .PB_SIN_REBOTE(inst22_pb_sin_rebote));
  ANTIREBOTE inst21 (.PB_N(PUNTAJES), .CLOCK_100Hz(CLK_100), .PB_SIN_REBOTE(inst21_pb_sin_rebote));
  ANTIREBOTE inst (.PB_N(RESET), .CLOCK_100Hz(CLK_100), .PB_SIN_REBOTE(RESET_N));
  RELOJ inst67 (
    .Enable(EN_RELOJ), .clear(CLEAR_RELOJ), .Clock(CLK_1seg), .Reset(RESET_N), .seg2(inst67_seg2),
    .seg4(inst67_seg4), .seg6(inst67_seg6), .seg8(inst67_seg8), .seg10(inst67_seg10), .seg12(inst67_seg12),
    .seg14(inst67_seg14), .seg16(inst67_seg16), .seg18(inst67_seg18), .seg20(inst67_seg20),
    .seg5(inst67_seg5), .seg3(inst67_seg3));
  RAM #(.DATA_WIDTH(8), .ADDRESS_WIDTH(5)) inst141 (
    .Clock(CLK), .Enable(RAM), .Reset(RESET_N), .DataIn(inst25_output), .Address(inst143_output),
    .WriteEn(\R/W ), .DataOut(inst141_dataout), .Loaded(SAVE));
  registro_sostenimiento inst140 (.clock(CLK), .reset(RESET_N), .enable(PRESIONO), .Ent(inst106_salida), .Q(inst140_q));
  not inst31 (inst31_out, inst23_pb_sin_rebote);
  not inst32 (inst32_out, inst22_pb_sin_rebote);
  not inst33 (inst33_out, inst21_pb_sin_rebote);
  generador_de_sonidos #(.n(65112)) inst12 (.clk(CLOCK), .pulso(inst12_pulso));
  generador_de_sonidos #(.n(58201)) inst13 (.clk(CLOCK), .pulso(inst13_pulso));
  mux2a1_8bits inst142 (
    .a(inst45_output), .b(inst25_output), .C(inst141_dataout), .seleccion(MOSTRAR_RAM),
    .salida(inst142_salida));
  generador_de_sonidos #(.n(39562)) inst14 (.clk(CLOCK), .pulso(inst14_pulso));
  generador_de_sonidos #(.n(27500)) inst15 (.clk(CLOCK), .pulso(inst15_pulso));
  generador_de_sonidos #(.n(65162)) inst16 (.clk(CLOCK), .pulso(inst16_pulso));
  generador_de_sonidos #(.n(51204)) inst17 (.clk(CLOCK), .pulso(inst17_pulso));
  generador_de_sonidos #(.n(40265)) inst18 (.clk(CLOCK), .pulso(inst18_pulso));
  generador_de_sonidos #(.n(10000)) inst19 (.clk(CLOCK), .pulso(inst19_pulso));
  generador_de_sonidos #(.n(56216)) inst20 (.clk(CLOCK), .pulso(inst20_pulso));
  generador_de_sonidos #(.n(33651)) inst29 (.clk(CLOCK), .pulso(inst29_pulso));
  Conv_Bin_BCD inst30 (.Bin(inst142_salida), .Dec(inst30_dec), .Uni(inst30_uni));  // open: Cen
  decoder_de_bcd_a_7segmentos inst26 (.BCD(inst30_dec), .SEG7(decenas));
  decoder_de_bcd_a_7segmentos inst27 (.BCD(inst30_uni), .SEG7(unidades));
  controlador inst139 (
    .CLOCK(CLK), .Reset(RESET_N), .START(inst31_out), .JUGAR(inst32_out), .PUNTAJES(inst33_out),
    .PRESIONO(PRESIONO), .VALOR_IGUAL(VALOR_IGUAL), .IGUAL1(IGUAL1), .IGUAL2(IGUAL2), .IGUAL3(IGUAL3),
    .IGUAL4(IGUAL4), .IGUAL5(IGUAL5), .IGUAL6(IGUAL6), .IGUAL7(IGUAL7), .IGUAL8(IGUAL8), .IGUAL9(IGUAL9),
    .IGUAL10(IGUAL10), .SEG2(inst67_seg2), .SEG4(inst67_seg4), .SEG6(inst67_seg6), .SEG8(inst67_seg8),
    .SEG10(inst67_seg10), .SEG12(inst67_seg12), .SEG14(inst67_seg14), .SEG16(inst67_seg16),
    .SEG18(inst67_seg18), .SEG20(inst67_seg20), .SEG5(inst67_seg5), .SEG3(inst67_seg3), .GUARDADO(SAVE),
    .EN1(EN1), .EN2(EN2), .EN3(EN3), .EN4(EN4), .EN5(EN5), .EN6(EN6), .EN7(EN7), .EN8(EN8), .EN9(EN9),
    .EN10(EN10), .INGRESO_DATO(EN_SONIDO), .EN_ALEATOREO(en_aleatoreo), .CLEAR_ALEATOREO(clear_aleatoreo),
    .EN_PUNTOS(en_puntos), .CLEAR_PUNTOS(clear_puntos), .EN_DIR(EN_DIR), .CLEAR_DIR(CLEAR_DIR),
    .EN_RELOJ(EN_RELOJ), .CLC_RELOJ(CLEAR_RELOJ), .RAM(RAM), .W(\R/W ), .MOSTRAR_RAM(MOSTRAR_RAM),
    .GANO(inst139_gano), .PERDIO(inst139_perdio));
  comparador inst118 (.w1(inst140_q), .w2(sonido1), .igual(IGUAL1));  // open: menor
  comparador inst119 (.w1(inst140_q), .w2(sonido2), .igual(IGUAL2));  // open: menor
  comparador inst120 (.w1(inst140_q), .w2(sonido3), .igual(IGUAL3));  // open: menor
  comparador inst121 (.w1(inst140_q), .w2(sonido4), .igual(IGUAL4));  // open: menor
  comparador inst122 (.w1(inst140_q), .w2(sonido5), .igual(IGUAL5));  // open: menor
  comparador inst123 (.w1(inst140_q), .w2(sonido6), .igual(IGUAL6));  // open: menor
  comparador inst124 (.w1(inst140_q), .w2(sonido7), .igual(IGUAL7));  // open: menor
  comparador inst125 (.w1(inst140_q), .w2(sonido8), .igual(IGUAL8));  // open: menor
  comparador inst126 (.w1(inst140_q), .w2(sonido9), .igual(IGUAL9));  // open: menor
  comparador inst127 (.w1(inst140_q), .w2(sonido10), .igual(IGUAL10));  // open: menor
  CONTADOR_BCD inst45 (
    .Enable(en_aleatoreo), .clear(clear_aleatoreo), .Clock(CLK_100), .Reset(RESET_N), .Output(inst45_output));
  mux2a1 inst1 (.A(CLK_1seg), .SLECT(inst139_gano), .Q(GANO));
  mux2a1 inst108 (.A(CLK_1seg), .SLECT(inst139_perdio), .Q(PERDIO));
  mux20a1 inst28 (
    .a(inst2_pulso), .b(inst12_pulso), .c(inst3_pulso), .d(inst13_pulso), .e(inst4_pulso), .f(inst14_pulso),
    .g(inst5_pulso), .h(inst15_pulso), .i(inst6_pulso), .j(inst16_pulso), .k(inst7_pulso), .l(inst17_pulso),
    .m(inst8_pulso), .n(inst18_pulso), .o(inst9_pulso), .p(inst19_pulso), .q(inst10_pulso), .r(inst20_pulso),
    .s(inst11_pulso), .t(inst29_pulso), .seleccion(inst45_output), .salida(PARLANTE));
  registro_sostenimiento inst35 (.clock(CLK), .reset(RESET_N), .enable(EN1), .Ent(inst45_output), .Q(sonido1));
  registro_sostenimiento inst36 (.clock(CLK), .reset(RESET_N), .enable(EN2), .Ent(inst45_output), .Q(sonido2));
  registro_sostenimiento inst37 (.clock(CLK), .reset(RESET_N), .enable(EN3), .Ent(inst45_output), .Q(sonido3));
  registro_sostenimiento inst38 (.clock(CLK), .reset(RESET_N), .enable(EN4), .Ent(inst45_output), .Q(sonido4));
  registro_sostenimiento inst39 (.clock(CLK), .reset(RESET_N), .enable(EN5), .Ent(inst45_output), .Q(sonido5));
  registro_sostenimiento inst40 (.clock(CLK), .reset(RESET_N), .enable(EN6), .Ent(inst45_output), .Q(sonido6));
  registro_sostenimiento inst41 (.clock(CLK), .reset(RESET_N), .enable(EN7), .Ent(inst45_output), .Q(sonido7));
  registro_sostenimiento inst42 (.clock(CLK), .reset(RESET_N), .enable(EN8), .Ent(inst45_output), .Q(sonido8));
  registro_sostenimiento inst43 (.clock(CLK), .reset(RESET_N), .enable(EN9), .Ent(inst45_output), .Q(sonido9));
  registro_sostenimiento inst44 (.clock(CLK), .reset(RESET_N), .enable(EN10), .Ent(inst45_output), .Q(sonido10));
  comparador inst47 (.w1(sonido1), .w2(inst45_output), .igual(inst47_igual));  // open: menor
  comparador inst48 (.w1(sonido2), .w2(inst45_output), .igual(inst48_igual));  // open: menor
  comparador inst49 (.w1(sonido3), .w2(inst45_output), .igual(inst49_igual));  // open: menor
  comparador inst50 (.w1(sonido4), .w2(inst45_output), .igual(inst50_igual));  // open: menor
  comparador inst51 (.w1(sonido5), .w2(inst45_output), .igual(inst51_igual));  // open: menor
  comparador inst52 (.w1(sonido6), .w2(inst45_output), .igual(inst52_igual));  // open: menor
  comparador inst53 (.w1(sonido7), .w2(inst45_output), .igual(inst53_igual));  // open: menor
  comparador inst54 (.w1(sonido8), .w2(inst45_output), .igual(inst54_igual));  // open: menor
  comparador inst55 (.w1(sonido9), .w2(inst45_output), .igual(inst55_igual));  // open: menor
  comparador inst56 (.w1(sonido10), .w2(inst45_output), .igual(inst56_igual));  // open: menor
  or inst61 (inst61_out, inst49_igual, inst50_igual);
  or inst60 (inst60_out, inst51_igual, inst52_igual);
  or inst58 (inst58_out, inst55_igual, inst56_igual);
  or inst62 (inst62_out, inst47_igual, inst48_igual);
  or inst59 (inst59_out, inst53_igual, inst54_igual);
  or inst63 (inst63_out, inst62_out, inst61_out);
  or inst64 (inst64_out, inst60_out, inst59_out);
  or inst65 (inst65_out, inst64_out, inst58_out);
  or inst66 (VALOR_IGUAL, inst63_out, inst65_out);
endmodule
